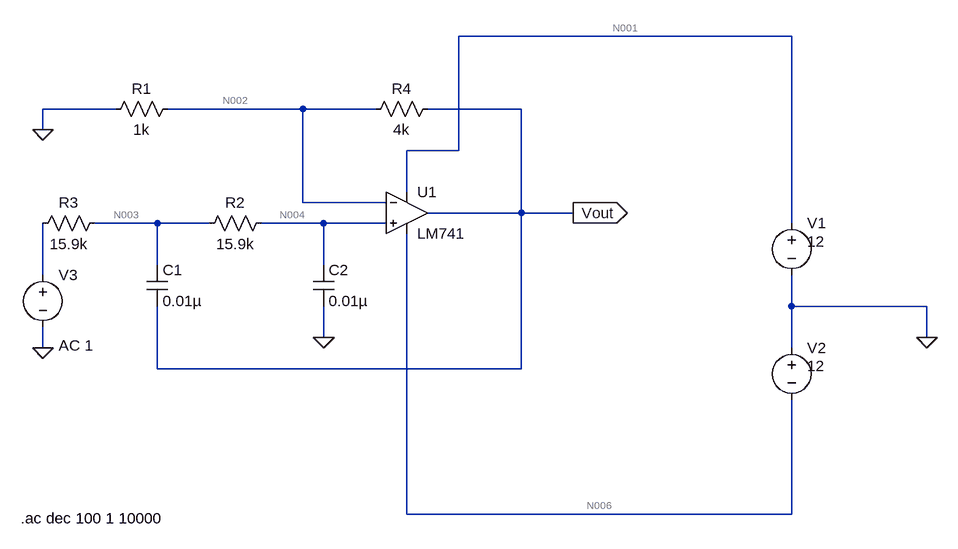
[diagram p0: schematic Draft1.asc]
Draft1.asc, the LTspice schematic file:
Version 4
SHEET 1 1252 680
WIRE 1024 -112 512 -112
WIRE -16 0 -128 0
WIRE 272 0 64 0
WIRE 384 0 272 0
WIRE 608 0 464 0
WIRE -128 32 -128 0
WIRE 512 64 512 -112
WIRE 512 64 432 64
WIRE 432 128 432 64
WIRE 272 144 272 0
WIRE 400 144 272 144
WIRE 608 160 608 0
WIRE 608 160 464 160
WIRE 688 160 608 160
WIRE 48 176 -48 176
WIRE 128 176 48 176
WIRE 304 176 208 176
WIRE 400 176 304 176
WIRE 1024 176 1024 -112
WIRE 48 240 48 176
WIRE 304 240 304 176
WIRE -128 256 -128 176
WIRE 1024 304 1024 256
WIRE 1232 304 1024 304
WIRE 304 352 304 304
WIRE 1232 352 1232 304
WIRE -128 368 -128 336
WIRE 1024 368 1024 304
WIRE 48 400 48 304
WIRE 608 400 608 160
WIRE 608 400 48 400
WIRE 432 624 432 192
WIRE 1024 624 1024 448
WIRE 1024 624 432 624
FLAG -128 368 0
FLAG -128 32 0
FLAG 688 160 Vout
IOPIN 688 160 Out
FLAG 1232 352 0
FLAG 304 352 0
SYMBOL res 80 -16 R90
WINDOW 0 0 56 VBottom 2
WINDOW 3 32 56 VTop 2
SYMATTR InstName R1
SYMATTR Value 1k
SYMBOL res -32 160 R90
WINDOW 0 0 56 VBottom 2
WINDOW 3 32 56 VTop 2
SYMATTR InstName R3
SYMATTR Value 15.9k
SYMBOL OpAmps\\LM741 432 96 R0
SYMATTR InstName U1
SYMBOL cap 32 240 R0
SYMATTR InstName C1
SYMATTR Value 0.01µ
SYMBOL res 480 -16 R90
WINDOW 0 0 56 VBottom 2
WINDOW 3 32 56 VTop 2
SYMATTR InstName R4
SYMATTR Value 4k
SYMBOL voltage 1024 160 R0
WINDOW 123 24 124 Left 2
WINDOW 39 0 0 Left 0
WINDOW 3 24 44 Left 2
SYMATTR InstName V1
SYMATTR Value 12
SYMBOL voltage 1024 352 R0
WINDOW 123 24 124 Left 2
WINDOW 39 0 0 Left 0
WINDOW 3 24 44 Left 2
SYMATTR InstName V2
SYMATTR Value 12
SYMBOL voltage -128 240 R0
WINDOW 123 24 124 Left 2
WINDOW 39 0 0 Left 0
SYMATTR InstName V3
SYMATTR Value ""
SYMATTR Value2 AC 1
SYMBOL res 224 160 R90
WINDOW 0 0 56 VBottom 2
WINDOW 3 32 56 VTop 2
SYMATTR InstName R2
SYMATTR Value 15.9k
SYMBOL cap 288 240 R0
SYMATTR InstName C2
SYMATTR Value 0.01µ
TEXT -162 630 Left 2 !.ac dec 100 1 10000

The netlist it stands for:
* Draft1.asc
R1 N002 0 1k
R3 N003 N005 15.9k
XU1 N004 N002 N001 N006 Vout LM741  ; pins In+ In- V+ V- OUT
C1 N003 Vout 0.01µ
R4 Vout N002 4k
V1 N001 0 12
V2 0 N006 12
V3 N005 0 AC 1
R2 N004 N003 15.9k
C2 N004 0 0.01µ
.ac dec 100 1 10000
.lib LM741.lib
.backanno
.end

* Results of the author's LTspice run, read from the files saved beside the schematic
* Operating Point, zero values left out:
*   V(n002) = -840 µV
*   V(n003) = -920 µV
*   V(n004) = -1.84 mV
*   V(n006) = -12 V
*   V(n001) = 12 V
*   V(vout) = -3.793 mV
*   I(R2) = -57.86 nA
*   I(R4) = -738.1 nA
*   I(R3) = -57.86 nA
*   I(R1) = -840 nA
*   I(V3) = -57.86 nA
*   I(V2) = -1.627 mA
*   I(V1) = -1.626 mA
*   Ix(u1:1) = 57.86 nA
*   Ix(u1:2) = 101.9 nA
*   Ix(u1:99) = 1.626 mA
*   Ix(u1:50) = -1.627 mA
*   Ix(u1:28) = 738.1 nA
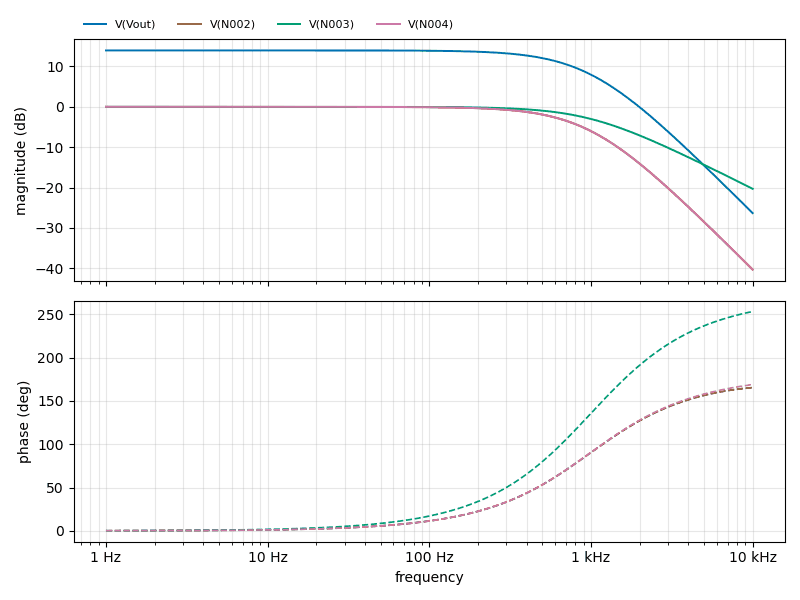
[diagram p1: AC Analysis of Draft1.asc, plotted from the saved traces]
* AC Analysis, 1 run:
*   V(Vout): 13.98 dB at 1 Hz, -26.32 dB at 10 kHz, peak 13.98 dB at 1 Hz, 3 dB below the peak at 647.8 Hz
*   V(N002): 0.00 dB at 1 Hz, -40.30 dB at 10 kHz, peak 0.00 dB at 1 Hz, 3 dB below the peak at 647.8 Hz
*   V(N003): -0.00 dB at 1 Hz, -20.30 dB at 10 kHz, peak -0.00 dB at 1 Hz, 3 dB below the peak at 1.002 kHz
*   V(N004): -0.00 dB at 1 Hz, -40.33 dB at 10 kHz, peak -0.00 dB at 1 Hz, 3 dB below the peak at 647.8 Hz